# EAGLE design radio (EAGLE 9.6.2)
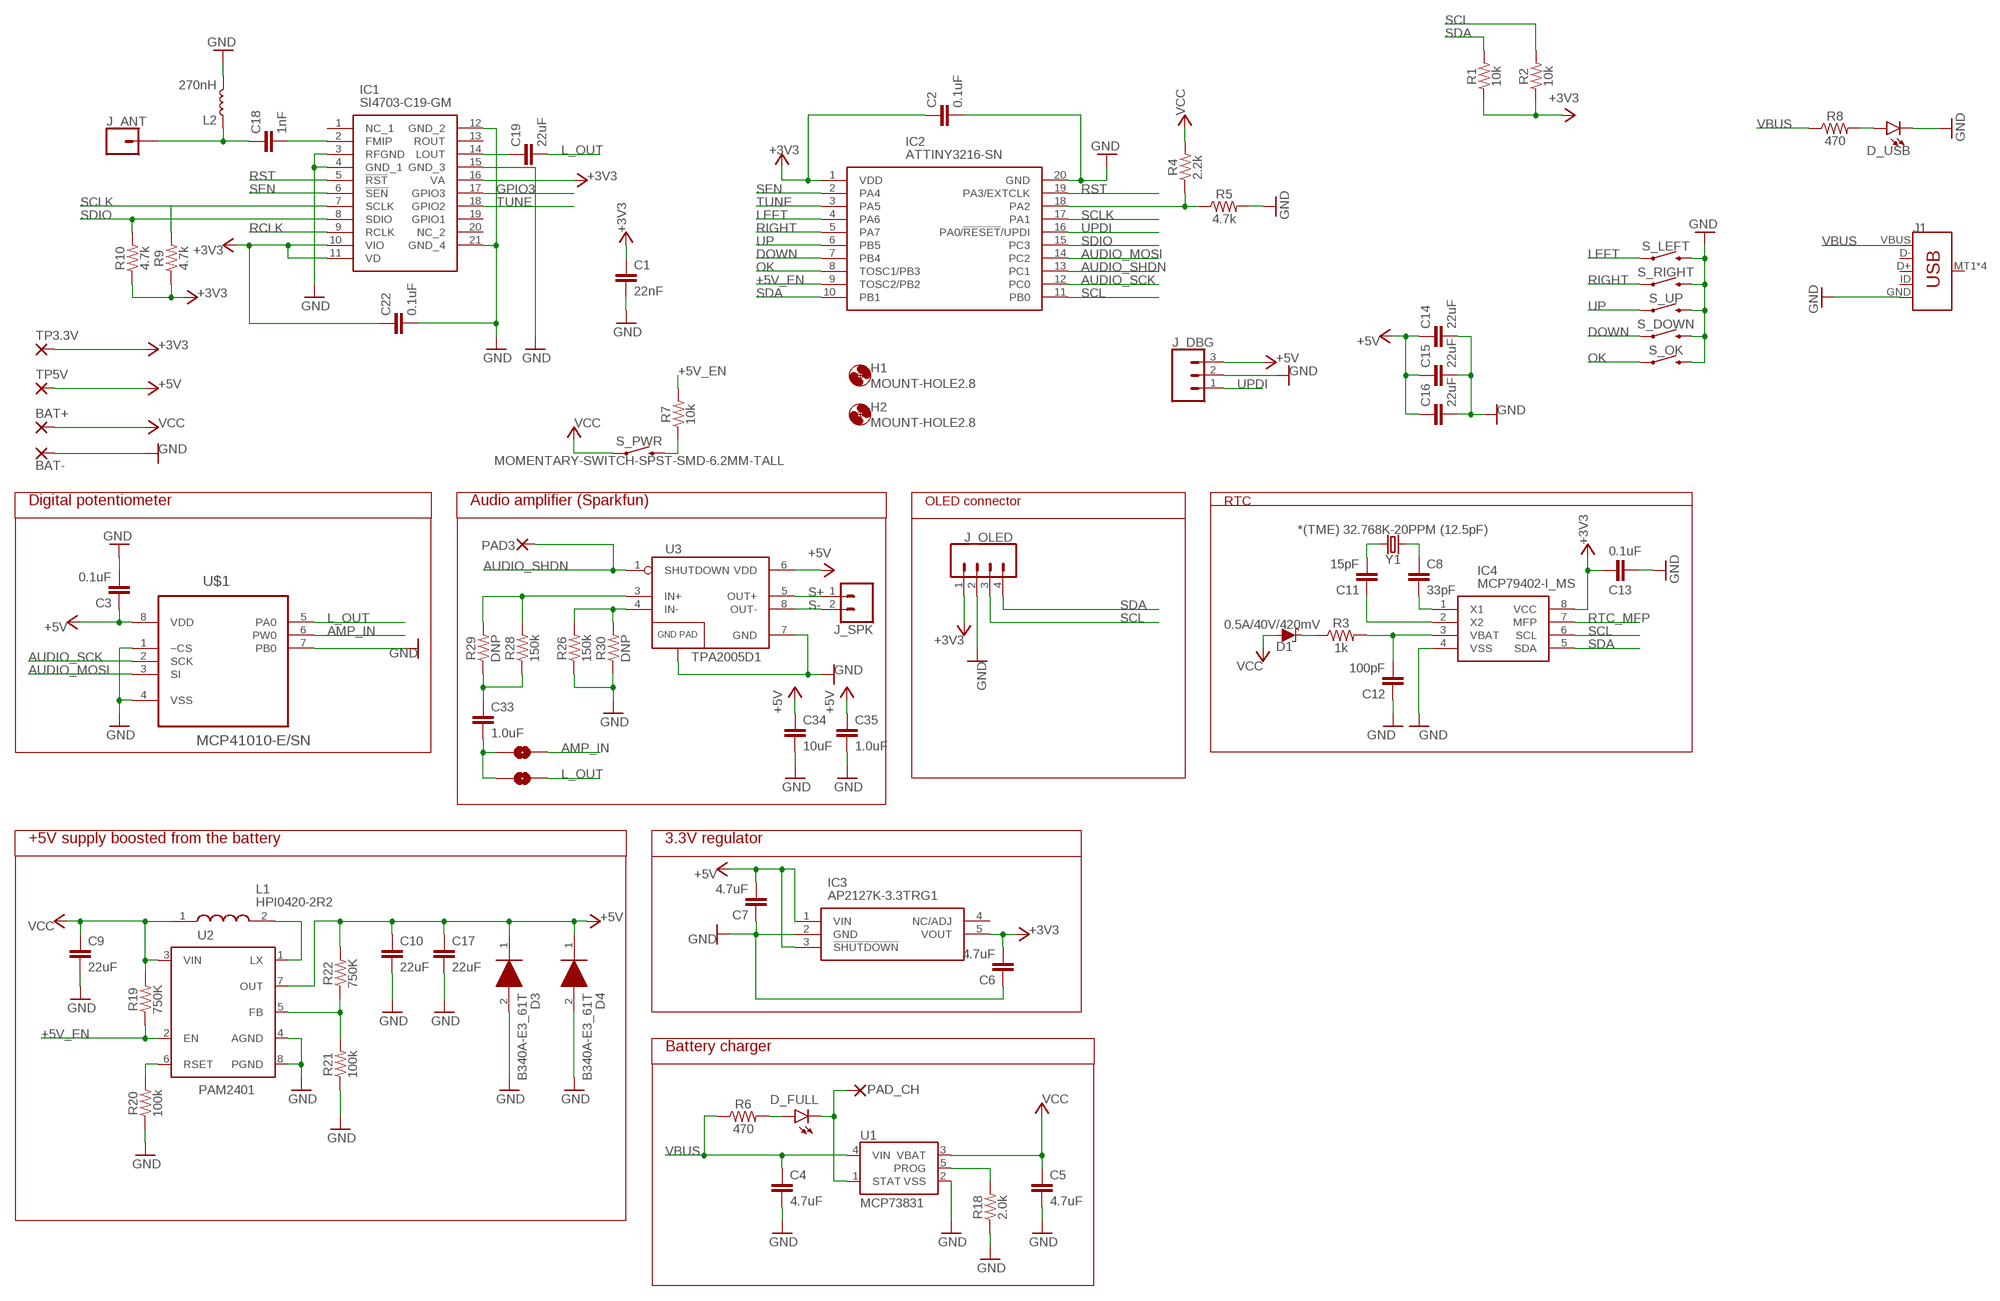
[diagram p0: schematic, sheet 1]

## Parts
BAT+  SMD2  [SMD1,27-2,54]
BAT-  SMD2  [SMD1,27-2,54]
C1  22nF  22NF/22,000PF-0603-50V-10%  [0603]
C2  0.1uF  0.1UF-0603-25V-5%  [0603]
C3  0.1uF  0.1UF-0603-25V-5%  [0603]
C4  4.7uF  4.7UF0603  [0603]
C5  4.7uF  4.7UF0603  [0603]
C6  4.7uF  4.7UF0603  [0603]
C7  4.7uF  4.7UF0603  [0603]
C8  33pF  33PF-0603-50V-5%  [0603]
C9  22uF  22UF-0805-6.3V-20%  [0805]
C10  22uF  22UF-0805-6.3V-20%  [0805]
C11  15pF  15PF-0603-50V-5%  [0603]
C12  100pF  100PF-0603-50V-5%  [0603]
C13  0.1uF  0.1UF-0603-25V-5%  [0603]
C14  22uF  22UF-0805-6.3V-20%  [0805]
C15  22uF  22UF-0805-6.3V-20%  [0805]
C16  22uF  22UF-0805-6.3V-20%  [0805]
C17  22uF  22UF-0805-6.3V-20%  [0805]
C18  1nF  1.0NF/1000PF-0603-50V-10%  [0603]
C19  22uF  22UF-0805-6.3V-20%  [0805]
C22  0.1uF  0.1UF-0603-25V-5%  [0603]
C33  1.0uF  1.0UF-0603-16V-10%  [0603]
C34  10uF  10UF-0805-10V-10%  [0805]
C35  1.0uF  1.0UF-0603-16V-10%  [0603]
D1  0.5A/40V/420mV  DIODE-SCHOTTKY-PMEG4005EJ  [SOD-323]
D3  B340A-E3_61T  [DIOM5127X229N]
D4  B340A-E3_61T  [DIOM5127X229N]
D_FULL  RED  LED5MM  [LED_5MM]
D_USB  LED5MM  [LED_5MM]
H1  MOUNT-HOLE2.8  [2,8]
H2  MOUNT-HOLE2.8  [2,8]
IC1  SI4703-C19-GM  [SI4703C19GM]
IC2  ATTINY3216-SN  [SOIC127P1030X265-20N]
IC3  AP2127K-3.3TRG1  [SOT95P282X145-5N]
IC4  MCP79402-I_MS  [SOP65P490X110-8N]
J1  USB_MICRO-B_SMT  [USB-MICROB]
J_ANT  CONN_01  [1X01]
J_DBG  CONN_03LOCK  [1X03_LOCK]
J_OLED  CONN_04LOCK  [1X04_LOCK]
J_SPK  CONN_02  [1X02]
JP1  JUMPER-SMT_2_NO_NO-SILK  [SMT-JUMPER_2_NO_NO-SILK]
JP2  JUMPER-SMT_2_NO_NO-SILK  [SMT-JUMPER_2_NO_NO-SILK]
L1  HPI0420-2R2  [HPI04202R2]
L2  270nH  INDUCTOR-0805-3.3UH  [0805]
PAD3  SMD2  [SMD1,27-2,54]
PAD_CH  SMD2  [SMD1,27-2,54]
R1  10k  10KOHM-0603-1/10W-1%  [0603]
R2  10k  10KOHM-0603-1/10W-1%  [0603]
R3  1k  1KOHM-0603-1/10W-1%  [0603]
R4  2.2k  2.2KOHM-0603-1/10W-1%  [0603]
R5  4.7k  4.7KOHM-0603-1/10W-1%  [0603]
R6  470  470OHM-0603-1/10W-1%  [0603]
R7  10k  10KOHM-0603-1/10W-1%  [0603]
R8  470  470OHM-0603-1/10W-1%  [0603]
R9  4.7k  4.7KOHM-0603-1/10W-1%  [0603]
R10  4.7k  4.7KOHM-0603-1/10W-1%  [0603]
R18  2.0k  2.0KOHM-0603-1/10W-5%  [0603]
R19  750K  750OHM-0603-1/10W-1%  [0603]
R20  100k  100KOHM-0603-1/10W-1%  [0603]
R21  100k  100KOHM-0603-1/10W-1%  [0603]
R22  750K  750OHM-0603-1/10W-1%  [0603]
R26  150k  150KOHM-0603-1/10W-1%  [0603]
R28  150k  150KOHM-0603-1/10W-1%  [0603]
R29  DNP  150KOHM-0603-1/10W-1%  [0603]
R30  DNP  150KOHM-0603-1/10W-1%  [0603]
S_DOWN  MOMENTARY-SWITCH-SPST-SMD-6.2MM-TALL  [TACTILE_SWITCH_SMD_6.2MM_TALL]
S_LEFT  MOMENTARY-SWITCH-SPST-SMD-6.2MM-TALL  [TACTILE_SWITCH_SMD_6.2MM_TALL]
S_OK  MOMENTARY-SWITCH-SPST-SMD-6.2MM-TALL  [TACTILE_SWITCH_SMD_6.2MM_TALL]
S_PWR  MOMENTARY-SWITCH-SPST-SMD-6.2MM-TALL  [TACTILE_SWITCH_SMD_6.2MM_TALL]
S_RIGHT  MOMENTARY-SWITCH-SPST-SMD-6.2MM-TALL  [TACTILE_SWITCH_SMD_6.2MM_TALL]
S_UP  MOMENTARY-SWITCH-SPST-SMD-6.2MM-TALL  [TACTILE_SWITCH_SMD_6.2MM_TALL]
TP3.3V  SMD2  [SMD1,27-2,54]
TP5V  SMD2  [SMD1,27-2,54]
U1  MCP73831  [SOT23-5]
U2  PAM2401  [MSOP8]
U3  TPA2005D1  TPA2005D1DGN  [POWER-SOP8]
U$1  MCP41010-E/SN  [SOIC127P600X175-8N]
Y1  *(TME) 32.768K-20PPM (12.5pF)  CRYSTAL-32.768KHZPTH-2X6  [CRYSTAL-PTH-2X6-CYL]

## Nets
+3V3 [Power]: C1.1 C2.1 C3.1 C6.2 C13.2 C22.1 IC1.10(VIO) IC1.11(VD) IC1.16(VA) IC2.1(VDD) IC3.5(VOUT) IC4.8(VCC) J_OLED.1 R1.1 R2.1 R9.1 R10.1 TP3.3V.1(P) U$1.8(VDD) ; supply symbol labelled +5V
+5V [Power]: C7.2 C10.1 C14.1 C15.1 C16.1 C17.1 C34.1 C35.1 D3.1(K) D4.1(K) IC3.1(VIN) IC3.3(!SHUTDOWN) J_DBG.3 R22.2 TP5V.1(P) U2.7(OUT) U3.6(VDD)
+5V_EN: IC2.9(TOSC2/PB2) R7.2 R19.1 U2.2(EN)
AMP_IN: JP1.2 U$1.6(PW0)
AUDIO_MOSI: IC2.14(PC2) U$1.3(SI)
AUDIO_SCK: IC2.12(PC0) U$1.2(SCK)
AUDIO_SHDN: IC2.13(PC1) PAD3.1(P) U3.1(SHUTDOWN)
DOWN: IC2.7(PB4) S_DOWN.A2
GND [Power]: BAT-.1(P) C1.2 C2.2 C3.2 C4.2 C5.2 C6.1 C7.1 C9.2 C10.2 C12.1 C13.1 C14.2 C15.2 C16.2 C17.2 C22.2 C34.2 C35.2 D3.2(A) D4.2(A) D_USB.K(C) IC1.3(RFGND) IC1.4(GND_1) IC1.12(GND_2) IC1.15(GND_3) IC1.21(GND_4) IC2.20(GND) IC3.2(GND) IC4.4(VSS) J1.GND J_DBG.2 J_OLED.2 L2.2 R5.2 R18.1 R20.1 R21.1 R26.1 R30.1 S_DOWN.B2 S_LEFT.B2 S_OK.B2 S_RIGHT.B2 S_UP.B2 U1.2(VSS) U2.4(AGND) U2.8(PGND) U3.7(GND) U3.9(GND) U$1.1(~CS) U$1.4(VSS) U$1.7(PB0)
GPIO3: IC1.17(GPIO3)
L_OUT: C19.2 JP2.2 U$1.5(PA0)
LEFT: IC2.4(PA6) S_LEFT.A2
N$1: C18.2 IC1.2(FMIP)
N$2: C8.1 Y1.1
N$3: C8.2 IC4.1(X1)
N$4: D_FULL.K(C) PAD_CH.1(P) U1.1(STAT)
N$5: D_FULL.A R6.2
N$6: C11.2 Y1.2
N$7: C11.1 IC4.2(X2)
N$8: C12.2 IC4.3(VBAT) R3.2
N$9: D1.C R3.1
N$10: R18.2 U1.5(PROG)
N$11: R20.2 U2.6(RSET)
N$12: IC2.18(PA2) R4.1 R5.1
N$13: R7.1 S_PWR.B2
N$14: D_USB.A R8.2
N$15: C18.1 J_ANT.1 L2.1
N$16: C19.1 IC1.14(LOUT)
N$21: L1.2 U2.1(LX)
N$22: R21.2 R22.1 U2.5(FB)
N$25: R28.2 R29.2 U3.3(IN+)
N$27: R26.2 R30.2 U3.4(IN-)
N$29: C33.1 R28.1 R29.1
N$34: C33.2 JP1.1 JP2.1
OK: IC2.8(TOSC1/PB3) S_OK.A2
RCLK: IC1.9(RCLK)
RIGHT: IC2.5(PA7) S_RIGHT.A2
RST: IC1.5(!RST) IC2.19(PA3/EXTCLK)
RTC_MFP: IC4.7(MFP)
S+: J_SPK.1 U3.5(OUT+)
S-: J_SPK.2 U3.8(OUT-)
SCL: IC2.11(PB0) IC4.6(SCL) J_OLED.3 R2.2
SCLK: IC1.7(SCLK) IC2.17(PA1) R9.2
SDA: IC2.10(PB1) IC4.5(SDA) J_OLED.4 R1.2
SDIO: IC1.8(SDIO) IC2.15(PC3) R10.2
SEN: IC1.6(!SEN) IC2.2(PA4)
TUNE: IC1.18(GPIO2) IC2.3(PA5)
UP: IC2.6(PB5) S_UP.A2
UPDI: IC2.16(PA0/!RESET!/UPDI) J_DBG.1
VBUS: C4.1 J1.VBUS R6.1 R8.1 U1.4(VIN)
VCC [Power]: BAT+.1(P) C5.1 C9.1 D1.A L1.1 R4.2 R19.2 S_PWR.A2 U1.3(VBAT) U2.3(VIN)
Unconnected: IC1.1(NC_1) IC1.13(ROUT) IC1.19(GPIO1) IC1.20(NC_2) IC3.4(NC/ADJ) J1.D+ J1.D- J1.ID J1.MT1(SHIELD) J1.MT2(SHIELD) J1.P$1(SHIELD) J1.P$2(SHIELD)

## Notes on the sheet
- Digital potentiometer | Audio amplifier (Sparkfun) | OLED connector | RTC
- +5V supply boosted from the battery | 3.3V regulator
- Battery charger

## Library data of the parts
BAT+ BAT- PAD3 PAD_CH TP3.3V TP5V = wirepad:SMD2: SMD PAD
C1 = SparkFun-Capacitors:22NF/22,000PF: 0.022uF/22nF/22,000pF ceramic capacitors A capacitor is a passive two-terminal electrical component used to store electrical energy temporarily in an electric field.; PROD_ID: CAP-07885
C2 C3 C13 C22 = SparkFun-Capacitors:0.1UF: 0.1µF ceramic capacitors A capacitor is a passive two-terminal electrical component used to store electrical energy temporarily in an electric field.; PROD_ID: CAP-08604
C4-C7 = SparkFun-Capacitors:4.7UF: 4.7µF ceramic capacitors A capacitor is a passive two-terminal electrical component used to store electrical energy temporarily in an electric field.; PROD_ID: CAP-08280
C8 = SparkFun-Capacitors:33PF: 33pF ceramic capacitors A capacitor is a passive two-terminal electrical component used to store electrical energy temporarily in an electric field.; PROD_ID: CAP-10142
C9 C10 C14-C17 C19 = SparkFun-Capacitors:22UF: 22µF ceramic capacitors A capacitor is a passive two-terminal electrical component used to store electrical energy temporarily in an electric field.; PROD_ID: CAP-08402
C11 = SparkFun-Capacitors:15PF: 15pF ceramic capacitors A capacitor is a passive two-terminal electrical component used to store electrical energy temporarily in an electric field.; PROD_ID: CAP-07881
C12 = SparkFun-Capacitors:100PF: 100pF/0.1nF ceramic capacitors A capacitor is a passive two-terminal electrical component used to store electrical energy temporarily in an electric field.; PROD_ID: CAP-07883
C18 = SparkFun-Capacitors:1.0NF/1000PF: 1nF/1,000pF ceramic capacitors A capacitor is a passive two-terminal electrical component used to store electrical energy temporarily in an electric field.; PROD_ID: CAP-07886
C33 C35 = SparkFun-Capacitors:1.0UF: 1µF ceramic capacitors A capacitor is a passive two-terminal electrical component used to store electrical energy temporarily in an electric field.; PROD_ID: CAP-00868
C34 = SparkFun-Capacitors:10UF: 10.0µF ceramic capacitors A capacitor is a passive two-terminal electrical component used to store electrical energy temporarily in an electric field.; PROD_ID: CAP-11330
D1 = SparkFun-DiscreteSemi:DIODE-SCHOTTKY: Schottky diode A Schottky diode is a semiconductor diode which has a low forward voltage drop and a very fast switching action.; PROD_ID: DIO-10955
D3 D4 = SamacSys_Parts:B340A-E3_61T: VISHAY - B340A-E3/61T - Schottky Rectifier, 40 V, 3 A, Single, DO-214AC (SMA), 2 Pins, 550 mV Source: Datasheet <https://ms.componentsearchengine.com/Datasheets/2/B340A-E3_61T.pdf>; ARROW_PART_NUMBER: B340A-E3/61T; ARROW_PRICE-STOCK: https://www.arrow.com/en/products/b340a-e361t/vishay; DESCRIPTION: VISHAY - B340A-E3/61T - Schottky Rectifier, 40 V, 3 A, Single, DO-214AC (SMA), 2 Pins, 550 mV; HEIGHT: 2.29mm; MANUFACTURER_NAME: Vishay; MANUFACTURER_PART_NUMBER: B340A-E3/61T; MOUSER_PART_NUMBER: 625-BD340A-E3/61T; MOUSER_PRICE-STOCK: https://www.mouser.co.uk/ProductDetail/Vishay-General-Semiconductor/B340A-E3-61T/?qs=tdXsjSi%2FIMY4I2dGLbnpzg%3D%3D
D_FULL D_USB = SparkFun-LED:LED: LED (Generic) Standard schematic elements and footprints for 5mm, 3mm, 1206, and 0603 sized LEDs. Generic LEDs with no color specified.
H1 H2 = holes:MOUNT-HOLE: MOUNTING HOLE with drill center marker
IC1 = SamacSys_Parts:SI4703-C19-GM: SILICON LABS - SI4703-C19-GM - RF RECEIVER, 108MHZ, -20 TO 85DEG C Source: Datasheet <https://www.mouser.com/datasheet/2/368/Si4702-03-C19-1397768.pdf>; ARROW_PART_NUMBER: SI4703-C19-GM; ARROW_PRICE-STOCK: https://www.arrow.com/en/products/si4703-c19-gm/silicon-labs; DESCRIPTION: SILICON LABS - SI4703-C19-GM - RF RECEIVER, 108MHZ, -20 TO 85DEG C; HEIGHT: 0.55mm; MANUFACTURER_NAME: Silicon Labs; MANUFACTURER_PART_NUMBER: Si4703-C19-GM; MOUSER_PART_NUMBER: 634-SI4703-C19-GM; MOUSER_PRICE-STOCK: https://www.mouser.co.uk/ProductDetail/Silicon-Labs/SI4703-C19-GM?qs=JiL6vA75y8O1ZAxL45qs%252BQ%3D%3D
IC2 = SamacSys_Parts:ATTINY3216-SN: MICROCHIP - ATTINY3216-SN - 8 Bit MCU, AVR Family ATtiny3216 Series Microcontrollers, 20 MHz, 32 KB, 2 KB, 20 Pins, SOIC Source: Datasheet <http://www.microchip.com/mymicrochip/filehandler.aspx?ddocname=en606269>; ARROW_PART_NUMBER: ATTINY3216-SN; ARROW_PRICE-STOCK: https://www.arrow.com/en/products/attiny3216-sn/microchip-technology; DESCRIPTION: MICROCHIP - ATTINY3216-SN - 8 Bit MCU, AVR Family ATtiny3216 Series Microcontrollers, 20 MHz, 32 KB, 2 KB, 20 Pins, SOIC; HEIGHT: 2.65mm; MANUFACTURER_NAME: Microchip; MANUFACTURER_PART_NUMBER: ATTINY3216-SN; MOUSER_PART_NUMBER: 579-ATTINY3216-SN; MOUSER_PRICE-STOCK: https://www.mouser.co.uk/ProductDetail/Microchip-Technology-Atmel/ATTINY3216-SN?qs=3HJ2avRr9PLFi4K6RTZWjQ%3D%3D
IC3 = SamacSys_Parts:AP2127K-3.3TRG1: DiodesZetex AP2127K-3.3TRG1, LDO Regulator, 3.3 V, +/-2% 5-Pin, SOT-23 Source: Datasheet <https://www.diodes.com/assets/Datasheets/AP2127.pdf>; ARROW_PART_NUMBER: AP2127K-3.3TRG1; ARROW_PRICE-STOCK: https://www.arrow.com/en/products/ap2127k-3.3trg1/diodes-incorporated; DESCRIPTION: DiodesZetex AP2127K-3.3TRG1, LDO Regulator, 3.3 V, +/-2% 5-Pin, SOT-23; HEIGHT: 1.45mm; MANUFACTURER_NAME: Diodes Inc.; MANUFACTURER_PART_NUMBER: AP2127K-3.3TRG1; MOUSER_PART_NUMBER: 621-AP2127K-3.3TRG1; MOUSER_PRICE-STOCK: https://www.mouser.co.uk/ProductDetail/Diodes-Incorporated/AP2127K-33TRG1?qs=x6A8l6qLYDCeAxisWuFs5g%3D%3D
IC4 = SamacSys_Parts:MCP79402-I_MS: Real Time Clock I2C GP RTCC 64B SRAM EUI-64 Source: Datasheet <https://ww1.microchip.com/downloads/en/DeviceDoc/MCP79400-MCP79401-MCP79402-Data-Sheet-20005009G.pdf>; ARROW_PART_NUMBER: MCP79402-I/MS; ARROW_PRICE-STOCK: https://www.arrow.com/en/products/mcp79402-ims/microchip-technology; DESCRIPTION: Real Time Clock I2C GP RTCC 64B SRAM EUI-64; HEIGHT: 1.1mm; MANUFACTURER_NAME: Microchip; MANUFACTURER_PART_NUMBER: MCP79402-I/MS; MOUSER_PART_NUMBER: 579-MCP79402IMS; MOUSER_PRICE-STOCK: https://www.mouser.co.uk/ProductDetail/Microchip-Technology/MCP79402-I-MS/?qs=ggQiQSXuoRUEDQIZeudJWQ%3D%3D
J1 = SparkFun-Connectors:USB_MICRO-B: USB Type Micro-B Connector Male/female and PTH/SMT variants SparkFun Products: SparkFun microB USB Breakout <https://www.sparkfun.com/products/12035> SparkFun USB microB Plug Breakout <https://www.sparkfun.com/products/10031> SparkFun ESP8266 Thing <https://www.sparkfun.com/products/13231>; PROD_ID: CONN-09505; SF_ID: PRT-08533
J_ANT = SparkFun-Connectors:CONN_01: Single connection point. Often used as Generic Header-pin footprint for 0.1 inch spaced/style header connections On any of the 0.1 inch spaced packages, you can populate with these: Break Away Headers - Straight <https://www.sparkfun.com/products/116> (PRT-00116) Break Away Male Headers - Right Angle <https://www.sparkfun.com/products/553> (PRT-00553) Female Headers <https://www.sparkfun.com/products/115> (PRT-00115) Break Away Headers - Machine Pin <https://www.sparkfun.com/products/117> (PRT-00117) Break Away Female Headers - Swiss Machine Pin <https://www.sparkfun.com/products/743> (PRT-00743) This device is also useful as a general connection point to wire up your design to another part of your project. Our various solder wires solder well into these plated through hole pads. Hook-Up Wire - Assortment (Stranded, 22 AWG) <https://www.sparkfun.com/products/11375> (PRT-11375) Hook-Up Wire - Assortment (Solid Core, 22 AWG) <https://www.sparkfun.com/products/11367> (PRT-11367) View the entire wire category on our website here <https://www.sparkfun.com/categories/141> Special notes: SMTSO-256-ET is a "flush mount" nut for a 4-40 screw. We mostly use this on specialty testbeds; it is a nice way to connect hardware to your PCB at an adjustable hieght. Also note, the SNAP packages are for using a snappable style connector. We sell a baggie of snaps and they are also used on two LilyPad designs: Snap Assortment - 30 pack (male and female) <https://www.sparkfun.com/products/11347> (DEV-11347) LilyPad Arduino SimpleSnap <https://www.sparkfun.com/products/10941> (DEV-10941) LilyPad SimpleSnap Protoboard <https://www.sparkfun.com/products/10940> (DEV-10940)
J_DBG = SparkFun-Connectors:CONN_03: Multi connection point. Often used as Generic Header-pin footprint for 0.1 inch spaced/style header connections On any of the 0.1 inch spaced packages, you can populate with these: Break Away Headers - Straight <https://www.sparkfun.com/products/116> (PRT-00116) Break Away Male Headers - Right Angle <https://www.sparkfun.com/products/553> (PRT-00553) Female Headers <https://www.sparkfun.com/products/115> (PRT-00115) Break Away Headers - Machine Pin <https://www.sparkfun.com/products/117> (PRT-00117) Break Away Female Headers - Swiss Machine Pin <https://www.sparkfun.com/products/743> (PRT-00743) Stackable Header - 3 Pin (Female, 0.1") <https://www.sparkfun.com/products/13875> (PRT-13875) For SCREWTERMINALS and SPRING TERMINALS visit here: Screw Terimnals on SparkFun.com <https://www.sparkfun.com/search/results?term=Screw+Terminals> (5mm/3.5mm/2.54mm spacing) This device is also useful as a general connection point to wire up your design to another part of your project. Our various solder wires solder well into these plated through hole pads. Hook-Up Wire - Assortment (Stranded, 22 AWG) <https://www.sparkfun.com/products/11375> (PRT-11375) Hook-Up Wire - Assortment (Solid Core, 22 AWG) <https://www.sparkfun.com/products/11367> (PRT-11367) View the entire wire category on our website here <https://www.sparkfun.com/categories/141> Special notes: Molex polarized connector foot print use with SKU : PRT-08232 with associated crimp pins and housings.
J_OLED = SparkFun-Connectors:CONN_04: Multi connection point. Often used as Generic Header-pin footprint for 0.1 inch spaced/style header connections On any of the 0.1 inch spaced packages, you can populate with these: Break Away Headers - Straight <https://www.sparkfun.com/products/116> (PRT-00116) Break Away Male Headers - Right Angle <https://www.sparkfun.com/products/553> (PRT-00553) Female Headers <https://www.sparkfun.com/products/115> (PRT-00115) Break Away Headers - Machine Pin <https://www.sparkfun.com/products/117> (PRT-00117) Break Away Female Headers - Swiss Machine Pin <https://www.sparkfun.com/products/743> (PRT-00743) For SCREWTERMINALS and SPRING TERMINALS visit here: Screw Terimnals on SparkFun.com <https://www.sparkfun.com/search/results?term=Screw+Terminals> (5mm/3.5mm/2.54mm spacing) This device is also useful as a general connection point to wire up your design to another part of your project. Our various solder wires solder well into these plated through hole pads. Hook-Up Wire - Assortment (Stranded, 22 AWG) <https://www.sparkfun.com/products/11375> (PRT-11375) Hook-Up Wire - Assortment (Solid Core, 22 AWG) <https://www.sparkfun.com/products/11367> (PRT-11367) View the entire wire category on our website here <https://www.sparkfun.com/categories/141> Special notes: Molex polarized connector foot print use with SKU : PRT-08231 with associated crimp pins and housings. 1MM SMD Version SKU: PRT-10208; PROD_ID: CONN-09696
J_SPK = SparkFun-Connectors:CONN_02: Multi connection point. Often used as Generic Header-pin footprint for 0.1 inch spaced/style header connections On any of the 0.1 inch spaced packages, you can populate with these: Break Away Headers - Straight <https://www.sparkfun.com/products/116> (PRT-00116) Break Away Male Headers - Right Angle <https://www.sparkfun.com/products/553> (PRT-00553) Female Headers <https://www.sparkfun.com/products/115> (PRT-00115) Break Away Headers - Machine Pin <https://www.sparkfun.com/products/117> (PRT-00117) Break Away Female Headers - Swiss Machine Pin <https://www.sparkfun.com/products/743> (PRT-00743) For SCREWTERMINALS and SPRING TERMINALS visit here: Screw Terimnals on SparkFun.com <https://www.sparkfun.com/search/results?term=Screw+Terminals> (5mm/3.5mm/2.54mm spacing) This device is also useful as a general connection point to wire up your design to another part of your project. Our various solder wires solder well into these plated through hole pads. Hook-Up Wire - Assortment (Stranded, 22 AWG) <https://www.sparkfun.com/products/11375> (PRT-11375) Hook-Up Wire - Assortment (Solid Core, 22 AWG) <https://www.sparkfun.com/products/11367> (PRT-11367) View the entire wire category on our website here <https://www.sparkfun.com/categories/141> Special notes: Molex polarized connector foot print use with: PRT-08233 with associated crimp pins and housings. 2.54_SCREWTERM for use with PRT-10571. 3.5mm Screw Terminal footprints for PRT-08084 5mm Screw Terminal footprints for use with PRT-08432
JP1 JP2 = SparkFun-Jumpers:JUMPER-SMT_2_NO: Normally open jumper This jumper has two pads in close proximity to each other. Apply solder to close the connection. Round pads are easier to solder for beginners, but are a lot larger. SparkFun Product that uses the round pads: SparkFun EL Sequencer <https://www.sparkfun.com/products/12781>
L1 = SamacSys_Parts:HPI0420-2R2: Inductor: wire; SMD; 2.2uH; Ioper: 3A; 60m; +/-20%; Isat: 3.5A Source: Datasheet <https://www.tme.eu/Document/b467ae6daee59df5e2ed68809c99b965/HPI0420.pdf>; DESCRIPTION: Inductor: wire; SMD; 2.2uH; Ioper: 3A; 60m; +/-20%; Isat: 3.5A; HEIGHT: 2mm; MANUFACTURER_NAME: FERROCORE; MANUFACTURER_PART_NUMBER: HPI0420-2R2
L2 = SparkFun-Coils:INDUCTOR: Inductors Resist changes in electrical current. Basically a coil of wire. SparkFun Products: SparkFun Load Cell Amplifier - HX711 <https://www.sparkfun.com/products/13879> IOIO-OTG - V2.2 <https://www.sparkfun.com/products/13613>; PROD_ID: NDUC-13076; VALUE: 3.3µH/±20%/450mA
R1 R2 R7 = SparkFun-Resistors:10KOHM: 10kΩ resistor A resistor is a passive two-terminal electrical component that implements electrical resistance as a circuit element. Resistors act to reduce current flow, and, at the same time, act to lower voltage levels within circuits. - Wikipedia; PROD_ID: RES-00824
R3 = SparkFun-Resistors:1KOHM: 1kΩ resistor A resistor is a passive two-terminal electrical component that implements electrical resistance as a circuit element. Resistors act to reduce current flow, and, at the same time, act to lower voltage levels within circuits. - Wikipedia; PROD_ID: RES-07856
R4 = SparkFun-Resistors:2.2KOHM: 2.2kΩ resistor A resistor is a passive two-terminal electrical component that implements electrical resistance as a circuit element. Resistors act to reduce current flow, and, at the same time, act to lower voltage levels within circuits. - Wikipedia; PROD_ID: RES-08272
R5 R9 R10 = SparkFun-Resistors:4.7KOHM: 4.7kΩ resistor A resistor is a passive two-terminal electrical component that implements electrical resistance as a circuit element. Resistors act to reduce current flow, and, at the same time, act to lower voltage levels within circuits. - Wikipedia; PROD_ID: RES-07857
R6 R8 = SparkFun-Resistors:470OHM: 470Ω resistor A resistor is a passive two-terminal electrical component that implements electrical resistance as a circuit element. Resistors act to reduce current flow, and, at the same time, act to lower voltage levels within circuits. - Wikipedia; PROD_ID: RES-07869
R18 = SparkFun-Resistors:2.0KOHM: 2kΩ resistor A resistor is a passive two-terminal electrical component that implements electrical resistance as a circuit element. Resistors act to reduce current flow, and, at the same time, act to lower voltage levels within circuits. - Wikipedia; PROD_ID: RES-08296
R19 R22 = SparkFun-Resistors:750OHM: 750Ω resistor A resistor is a passive two-terminal electrical component that implements electrical resistance as a circuit element. Resistors act to reduce current flow, and, at the same time, act to lower voltage levels within circuits. - Wikipedia; PROD_ID: RES-07824; VALUE: 750
R20 R21 = SparkFun-Resistors:100KOHM: 100kΩ resistor A resistor is a passive two-terminal electrical component that implements electrical resistance as a circuit element. Resistors act to reduce current flow, and, at the same time, act to lower voltage levels within circuits. - Wikipedia; PROD_ID: RES-07828
R26 R28 = SparkFun-Resistors:150KOHM: 150kΩ resistor A resistor is a passive two-terminal electrical component that implements electrical resistance as a circuit element. Resistors act to reduce current flow, and, at the same time, act to lower voltage levels within circuits. - Wikipedia; PROD_ID: RES-09117
R29 R30 = SparkFun-Resistors:150KOHM: 150kΩ resistor A resistor is a passive two-terminal electrical component that implements electrical resistance as a circuit element. Resistors act to reduce current flow, and, at the same time, act to lower voltage levels within circuits. - Wikipedia; PROD_ID: RES-09117; VALUE: 150k
S_DOWN S_LEFT S_OK S_PWR S_RIGHT S_UP = SparkFun-Switches:MOMENTARY-SWITCH-SPST: Momentary Switch (Pushbutton) - SPST Normally-open (NO) SPST momentary switches (buttons, pushbuttons). Variants PTH-12MM - 12mm square, through-hole Momentary Pushbutton Switch - 12mm Square <https://www.sparkfun.com/products/9190> (COM-09190) PTH-6.0MM, PTH-6.0MM-KIT - 6.0mm square, through-hole Mini Pushbutton Switch <https://www.sparkfun.com/products/97> (COM-00097) KIT package intended for soldering kit's - only one side of pads' copper is exposed. PTH-RIGHT-ANGLE-KIT - Right-angle, through-hole Right Angle Tactile Button <https://www.sparkfun.com/products/10791> - Used on SparkFun BigTime Watch Kit <https://www.sparkfun.com/products/11734> SMD-12MM - 12mm square, surface-mount Tactile Button - SMD (12mm) <https://www.sparkfun.com/products/12993> (COM-12993) Used on SparkFun PicoBoard <https://www.sparkfun.com/products/11888> SMD-4.5MM - 4.5mm Square Trackball Switch Used on SparkFun Blackberry Trackballer Breakout <https://www.sparkfun.com/products/13169> SMD-4.6MMX2.8MM - 4.60mm x 2.80mm, surface mount Used on SparkFun SAMD21 Mini Breakout <https://www.sparkfun.com/products/13664> SMD-5.2MM, SMD-5.2-REDUNDANT - 5.2mm square, surface-mount Mini Pushbutton Switch - SMD <https://www.sparkfun.com/products/8720> (COM-08720) Used on Arduino Pro Mini <https://www.sparkfun.com/products/11114> REDUNDANT package connects both switch circuits together SMD-6.0X3.5MM - 6.0 x 3.5mm, surface mount Momentary Reset Switch SMD <https://www.sparkfun.com/products/8229> (COM-08229) SMD-6.2MM-TALL - 6.2mm square, surface mount Tactile Button - SMD (6mm) <https://www.sparkfun.com/products/12992> Used on SparkFun Digital Sandbox <https://www.sparkfun.com/products/12651> SMD-RIGHT-ANGLE - Right-angle, surface mount Used on SparkFun Block for Intel® Edison - Arduino <https://www.sparkfun.com/products/13036>; PROD_ID: SWCH-11966; SF_SKU: COM-12992
U1 = SparkFun-IC-Power:MCP73831: MCP73831T Li-Ion, Li-Pol Controller Miniature single cell, fully integrated Li-Ion, Li-polymer charge management controller Datasheet <http://ww1.microchip.com/downloads/en/DeviceDoc/20001984g.pdf> SparkFun Products: SparkFun ESP32 Thing <https://www.sparkfun.com/products/13907> SparkFun 9DoF Razor IMU M0 <https://www.sparkfun.com/products/14001>; PROD_ID: IC-09995
U2 = SparkFun-IC-Power:PAM2401: PAM2401 - Boost PMIC Specifications: Up to 1A output current 0.9V to 4.75V Input Range 2.5V to 5.0V Adjustable Output Voltage Datasheet <https://www.diodes.com/assets/Datasheets/PAM2401.pdf> (Diodes inc.); PROD_ID: IC-XXXXX
U3 = SparkFun-IC-Amplifiers:TPA2005D1: 1.4W MONO CLASS-D AUDIO POWER AMPLIFIER The TPA2005D1 is a 1.4-W high efficiency filter-free class-D audio power amplifier in a BGA, QFN, or MSOP package that requires only three external components. Datasheet: http://focus.ti.com/lit/ds/symlink/tpa2005d1.pdf 1.4 W Into 8 ? From a 5V Supply at THD = 10% (Typ) Maximum Battery Life and Minimum Heat Efficiency With an 8-? Speaker: 84% at 400 mW, 79% at 100 mW 2.8-mA Quiescent Current 0.5-mA Shutdown Current Ideal for Wireless or Cellular Handsets and PDAs Capable of Driving an 8-? Speaker (2.5 V ? VDD ? 5.5 V) and a 4-? Speaker (2.5 V ? VDD ? 4.2 V) Only Three External Components Optimized PWM Output Stage Eliminates LC Output Filter Internally Generated 250-kHz Switching Frequency Eliminates Capacitor and Resistor Improved PSRR (-71 dB at 217 Hz) and Wide Supply Voltage (2.5 V to 5.5 V) Eliminates Need for a Voltage Regulator Fully Differential Design Reduces RF Rectification and Eliminates Bypass Capacitor Improved CMRR Eliminates Two Input Coupling Capacitors SparkFun Products SparkFun Mono Audio Amp Breakout - TPA2005D1 <https://www.sparkfun.com/products/11044> (BOB-11044) Note: SparkFun currenly only uses the QFN style part; PROD_ID: NA-XXXXX
U$1 = Microchip_By_element14_Batch_1:MCP41010-E/SN: Digital Potentiometer; MPN: MCP41010-E/SN; OC_FARNELL: 1332109; OC_NEWARK: 34M7457; PACKAGE: SOIC-8; SUPPLIER: Microchip
Y1 = SparkFun-Clocks:CRYSTAL-32.768KHZ: 32.768kHz Crystal Frequency: 32.768kHz Frequency Stability: ±20ppm Load Capacitance: 12.5pF (PTH-2X6 & SMD-3.2X1.5), 6pF (SMD-2X6) SparkFun Products: SparkFun BigTime Watch Kit <https://www.sparkfun.com/products/11734> SparkFun nRF52832 Breakout <https://www.sparkfun.com/products/13990> SparkFun Real Time Clock Module <https://www.sparkfun.com/products/12708>; PROD_ID: XTAL-10112; VALUE: 32.768kHz

## Board
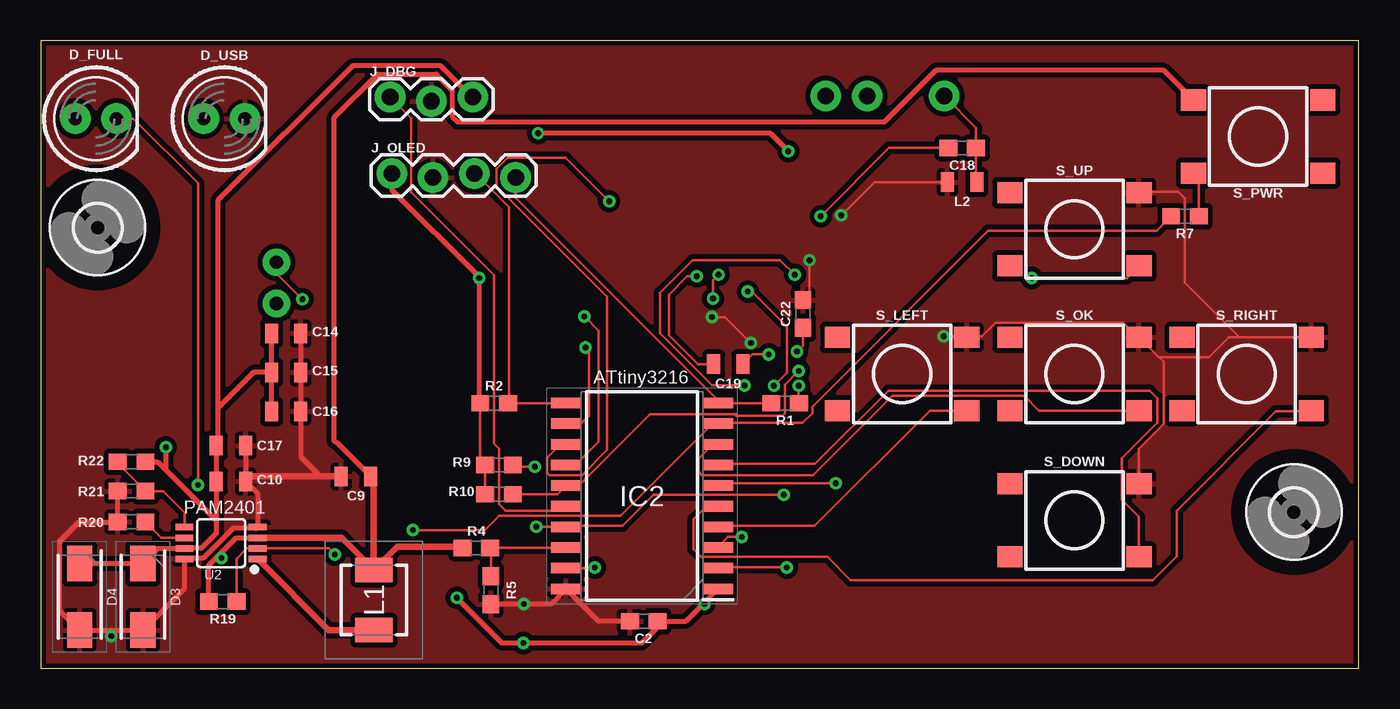
[diagram p1: board, top side]
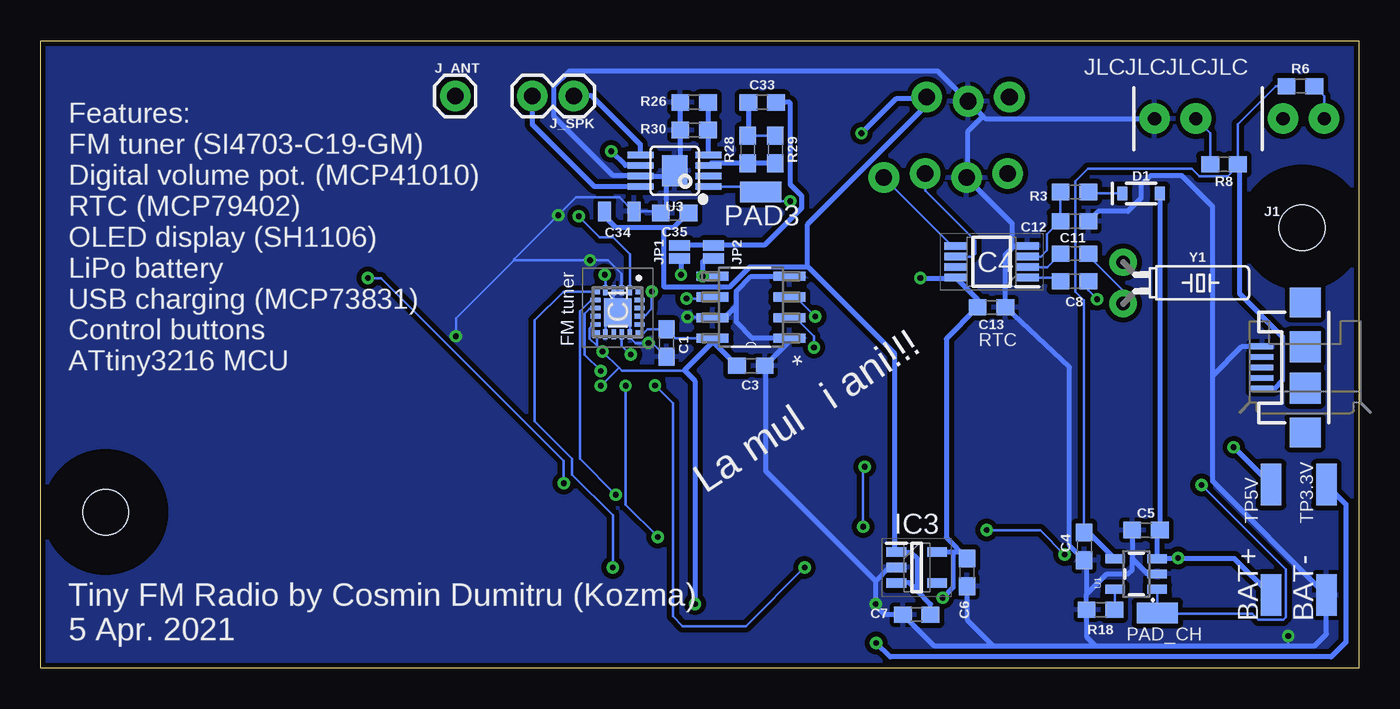
[diagram p2: board, bottom side, seen from below]

Size 81.1 x 38.6 mm. Coordinates in mm from the lower left corner, seen from the top.
Outline: 0,0 81.1,0 81.1,38.6 0,38.6 0,0
Copper layers (1*16): Top 0.035mm / dielectric 1.5mm / Bottom 0.035mm
Design rules "default *": minimum track width 6mil, minimum drill 0.35mm, track to track 3mil, track to pad 3mil, pad to pad 3mil, via to via 3mil, smd to smd 3mil, copper to edge 10mil, drill to drill 6mil, minimum pad ring 10mil, minimum via ring 8mil, stop-mask expansion 0mil, vias tented up to drill 40mil, thermal gap 10mil

### Footprints (pad centres in the part's own frame; a part is rotated, then mirrored left to right if it is on the bottom)
SMD1,27-2,54 = smd 1.27 x 2.54: 1 0,0
0603 = smd 1.1 x 1: 1 -0.85,0; 2 0.85,0
0805 = smd 0.8 x 1.2: 1 -0.9,0; 2 0.9,0
SOD-323 = smd 0.63 x 0.83: A 1.15,0; C -1.15,0
DIOM5127X229N = smd 2.2 x 1.55: 1 -2.05,0; 2 2.05,0
LED_5MM = drill 0.813 pad 1.88: A -1.27,0; K 1.27,0
2,8 = hole 2.8: 0,0
SI4703C19GM = smd 0.34 x 0.34: 1 -1.265,1.265; 6 -1.265,-1.265; 11 1.265,-1.265; 16 1.265,1.265 | smd 0.61 x 0.28: 2 -1.355,0.75; 3 -1.355,0.25; 4 -1.355,-0.25; 5 -1.355,-0.75; 12 1.355,-0.75; 13 1.355,-0.25; 14 1.355,0.25; 15 1.355,0.75 | smd 0.28 x 0.61: 7 -0.75,-1.355; 8 -0.25,-1.355; 9 0.25,-1.355; 10 0.75,-1.355; 17 0.75,1.355; 18 0.25,1.355; 19 -0.25,1.355; 20 -0.75,1.355 | smd 1.7 x 1.7: 21 0,0
SOIC127P1030X265-20N = smd 1.85 x 0.65: 1 -4.675,5.715; 2 -4.675,4.445; 3 -4.675,3.175; 4 -4.675,1.905; 5 -4.675,0.635; 6 -4.675,-0.635; 7 -4.675,-1.905; 8 -4.675,-3.175; 9 -4.675,-4.445; 10 -4.675,-5.715; 11 4.675,-5.715; 12 4.675,-4.445; 13 4.675,-3.175; 14 4.675,-1.905; 15 4.675,-0.635; 16 4.675,0.635; 17 4.675,1.905; 18 4.675,3.175; 19 4.675,4.445; 20 4.675,5.715
SOT95P282X145-5N = smd 1.2 x 0.6: 1 -1.25,0.95; 2 -1.25,0; 3 -1.25,-0.95; 4 1.25,-0.95; 5 1.25,0.95
SOP65P490X110-8N = smd 1.4 x 0.45: 1 -2.2,0.975; 2 -2.2,0.325; 3 -2.2,-0.325; 4 -2.2,-0.975; 5 2.2,-0.975; 6 2.2,-0.325; 7 2.2,0.325; 8 2.2,0.975
USB-MICROB = smd 1.4 x 0.35: D+ -2.65,0; D- -2.65,-0.65; GND -2.65,1.3; ID -2.65,0.65; VBUS -2.65,-1.3 | smd 1.9 x 1.8: MT1 0,-4; MT2 0,4 | smd 1.9 x 1.9: P$1 0,-1.27; P$2 0,1.27
1X01 = drill 1.016 pad 1.88: 1 0,0
1X03_LOCK = drill 1.016 pad 1.88: 1 0,0.127; 2 2.54,-0.127; 3 5.08,0.127
1X04_LOCK = drill 1.016 pad 1.88: 1 0,0.127; 2 2.54,-0.127; 3 5.08,0.127; 4 7.62,-0.127
1X02 = drill 1.016 pad 1.88: 1 0,0; 2 2.54,0
SMT-JUMPER_2_NO_NO-SILK = smd 0.635 x 1.27: 1 -0.406,0; 2 0.406,0
HPI04202R2 = smd 1.5 x 2.3: 1 -1.85,0; 2 1.85,0
TACTILE_SWITCH_SMD_6.2MM_TALL = smd 1.55 x 1.3: A1 -3.975,-2.25; A2 3.975,-2.25; B1 -3.975,2.25; B2 3.975,2.25
SOT23-5 = smd 0.55 x 1.2: 1 -0.95,-1.3; 2 0,-1.3; 3 0.95,-1.3; 4 0.95,1.3; 5 -0.95,1.3
MSOP8 = smd 0.4 x 1.1: 1 -0.975,-2.25; 2 -0.325,-2.25; 3 0.325,-2.25; 4 0.975,-2.25; 5 0.975,2.25; 6 0.325,2.25; 7 -0.325,2.25; 8 -0.975,2.25
POWER-SOP8 = smd 0.4 x 1.6: 1 -0.975,-2.1; 2 -0.325,-2.1; 3 0.325,-2.1; 4 0.975,-2.1; 5 0.975,2.1; 6 0.325,2.1; 7 -0.325,2.1; 8 -0.975,2.1 | smd 1.89 x 1.57: 9 0,0
SOIC127P600X175-8N = smd 1.981 x 0.559: 1 -2.362,1.905; 2 -2.362,0.635; 3 -2.362,-0.635; 4 -2.362,-1.905; 5 2.362,-1.905; 6 2.362,-0.635; 7 2.362,0.635; 8 2.362,1.905
CRYSTAL-PTH-2X6-CYL = drill 0.813 pad 1.676: 1 -1.27,0; 2 1.27,0

### Placement (x,y rotation side)
BAT+  5.4,4.5 0 bottom
BAT-  2,4.5 0 bottom
C1  42.6,20 270 bottom
C2  37.1,2.9 180 top
C3  37.4,18.6 0 bottom
C4  16.9,7.5 270 bottom
C5  13.1,8.5 180 bottom
C6  24.1,5.9 90 bottom
C7  27.2,3.3 0 bottom
C8  17.5,23.8 180 bottom
C9  19.4,11.8 180 top
C10  11.7,11.5 0 top
C11  17.5,25.5 0 bottom
C12  17.5,27.5 180 bottom
C13  22.6,22.2 180 bottom
C14  15.1,20.6 0 top
C15  15.1,18.2 0 top
C16  15.1,15.8 0 top
C17  11.7,13.7 0 top
C18  56.7,32 180 top
C19  42.3,18.7 180 top
C22  46.9,21.8 90 top
C33  36.7,34.8 0 bottom
C34  45.5,28.1 0 bottom
C35  42.1,28 180 bottom
D1  13.4,29.2 0 bottom
D3  6.3,4.4 270 top
D4  2.4,4.4 270 top
D_FULL  3.4,33.8 0 top
D_USB  11.3,33.8 0 top
H1  77.1,9.6 0 top
H2  3.5,27.1 0 top
IC1  45.6,21.9 270 bottom
IC2  37,10.6 180 top
IC3  27.2,6.2 0 bottom
IC4  22.6,25 180 bottom
J1  3.3,18.5 0 bottom
J_ANT  55.6,35.2 0 bottom
J_DBG  21.5,35 0 top
J_OLED  21.6,30.3 0 top
J_SPK  48.3,35.2 180 bottom
JP1  41.8,25.6 270 bottom
JP2  39.7,25.6 270 bottom
L1  20.5,4.2 270 top
L2  56.7,29.9 180 top
PAD3  36.8,29.3 90 bottom
PAD_CH  12.4,3.4 270 bottom
R1  45.8,16.3 180 top
R2  27.9,16.3 0 top
R3  17.5,29.3 180 bottom
R4  26.8,7.4 180 top
R5  27.7,4.8 270 top
R6  3.6,35.8 0 bottom
R7  70.4,27.8 180 top
R8  8.3,31 180 bottom
R9  28.2,12.5 0 top
R10  28.2,10.7 0 top
R18  15.9,3.6 0 bottom
R19  11.2,4.1 180 top
R20  5.6,9 0 top
R21  5.6,10.9 0 top
R22  5.6,12.7 0 top
R26  40.9,34.8 0 bottom
R28  37.6,31.9 270 bottom
R29  35.9,31.9 270 bottom
R30  40.9,33.1 0 bottom
S_DOWN  63.6,9.1 0 top
S_LEFT  53,18.1 0 top
S_OK  63.6,18.1 0 top
S_PWR  74.9,32.7 180 top
S_RIGHT  74.2,18.1 0 top
S_UP  63.6,27 0 top
TP3.3V  2,11.3 0 bottom
TP5V  5.4,11.3 0 bottom
U1  13.7,5.8 90 bottom
U2  11.1,7.7 90 top
U3  42.1,30.6 90 bottom
U$1  37.4,22.2 180 bottom
Y1  14.5,23.7 270 bottom

### Tracks (layer width: path | path; a pad name or v marks a point on that pad's centre or on a via)
+3V3  (via drill 0.35)
  Top 0.152: v46.63,17.37 46.63,16.31 R1.1 | v40.84,3.96 40.8,4.01 | 26.98,16.31 R2.1 27.05,12.8 R9.1 R10.1 | C22.1 46.9,19.85 v46.53,19.47
  Top 0.305: IC2.1 40.8,4.01 39.69,2.9 C2.1 37.95,2.52 36.98,1.55 v29.7,1.55 28.39,1.55 v25.6,4.34 | 26.98,16.31 v26.98,24 26.98,24.07 21.6,29.45 J_OLED.1
  Bottom 0.152: 39.76,20.11 U$1.8 | 45.53,18.48 45.34,18.29 41.53,18.29 41.49,18.33 | 45.53,18.48 v46.53,19.47 46.88,19.82 | 46.88,19.82 47.32,20.27 47.32,20.88 47.09,21.11 47.02,21.11 IC1.10 | 39.78,20.04 U$1.8 | 45.53,18.48 v46.63,17.37 | 23.55,22.1 C13.2 | 24.92,24 IC4.8 | IC1.16 43.97,20.64 43.75,20.85 C1.1 42.04,20.29 U$1.8 | IC1.11 46.88,19.82
  Bottom 0.305: 24.97,7.15 24.5,7.15 C6.2 25.38,8.03 25.38,20.26 23.55,22.1 | 24.97,7.15 IC3.5 | 39.76,20.11 C3.1 | C13.2 23.45,22.68 IC4.8 | 39.78,20.04 41.49,18.33 40.84,17.68 v40.84,3.96 | v26.98,24 24.92,24 | v25.6,4.34 24.97,4.98 24.97,7.15 | TP3.3V.1 0.8,10.1 0.8,1.6 1.7,0.7 28.85,0.7 v29.7,1.55
+5V  (via drill 0.35)
  Top 0.152: 10.9,13.79 C17.1 | 26.52,35.13 J_DBG.3
  Top 0.305: D4.1 D3.1 7.22,7.38 U2.7 9.88,7.38 10.8,8.3 10.8,9.1 | R22.2 7.2,12.7 7.7,12.2 | 7.7,12.2 10.8,9.1 | 10.8,9.1 C10.1 C17.1 | 10.9,16 10.9,28.77 19.18,37.05 24.59,37.05 26.52,35.13 | 10.9,16 10.9,13.79 | v46,31.8 44.9,32.9 v30.6,32.9 | v7.7,13.6 7.7,12.2 | C16.1 C15.1 | C15.1 C14.1 | C15.1 13.1,18.2 10.9,16
  Bottom 0.152: 46.4,27.8 C34.1 | 33.85,24.65 33.88,24.69 33.91,24.71 | 28.57,7.24 IC3.1 | 26.59,35.05 J_DBG.3
  Bottom 0.305: C7.2 26.35,3.95 27.2,4.8 | IC3.3 27.65,5.25 27.2,4.8 | IC3.1 27.55,7.15 27.2,6.8 27.2,4.8 | C35.1 42.15,27.1 42.77,27.1 | 42.77,27.1 45.7,27.1 46.4,27.8 | 42.77,27.1 42.77,23.47 38.69,23.47 37.47,24.69 33.88,24.69 | 28.57,7.24 28.57,19.38 33.85,24.65 | 33.91,24.71 33.91,27.3 26.59,34.62 26.59,35.05 28.45,35.05 v30.6,32.9 | U3.6 45.12,30.93 v46,31.8 | TP5V.1 v7.7,13.6
+5V_EN  (via drill 0.35)
  Top 0.152: R19.1 12.05,6.75 12.68,7.38 U2.2 17.73,7.38 v18.1,7 | R7.2 69.55,27.79 68.66,26.89 58.29,26.89 47.47,16.08 47.47,15.7 46.86,15.09 41.68,15.09 IC2.9 41.6,15.01 41.3,15.01 35.66,9.37 28.19,9.37 27.32,8.5 v22.9,8.5
  Bottom 0.152: v18.1,7 19.61,8.5 v22.9,8.5
AMP_IN  (via drill 0.35)
  Top 0.152: v41.7,24.2 41.36,23.86 v41.36,22.73
  Bottom 0.152: v41.36,22.73 39.86,22.73 U$1.6
  Bottom 0.305: JP1.2 41.7,25.09 v41.7,24.2
AUDIO_MOSI  (via drill 0.35)
  Top 0.152: v33.45,21.64 34.34,20.75 34.34,13.95 32.97,12.57 32.38,12.57 IC2.14
  Bottom 0.152: v33.45,21.64 34.59,22.78 34.98,22.78 U$1.3
AUDIO_SCK  (via drill 0.35)
  Top 0.152: v33.53,19.74 33.73,19.54 33.73,15.53 33.29,15.09 32.38,15.09 IC2.12
  Bottom 0.152: v33.53,19.74 33.53,20.42 34.67,21.57 34.98,21.57 U$1.2
AUDIO_SHDN  (via drill 0.35)
  Top 0.152: v34.98,28.73 32.31,31.39 28.73,31.39 28.04,30.71 28.04,29.64 34.84,22.84 34.84,13.43 33.3,11.89 31.32,11.89 31.17,12.04 31.17,12.95 31.93,13.72 32.31,13.72 IC2.13
  Bottom 0.152: U3.1 37.12,29.62 PAD3.1 36.73,29.26 36.2,28.73 v34.98,28.73
DOWN
  Top 0.152: IC2.7 41.68,12.57 47.65,12.57 52.15,17.07 68.23,17.07 68.69,16.61 68.69,15.09 66.53,12.93 66.53,10.38 67.58,9.34 S_DOWN.A2
GND  (via drill 0.35)
  Top 0.152: 12.8,11.8 12.6,11.6 | 74.1,20.35 73.09,20.34 71.87,19.13 68.89,19.13 | 68.89,19.13 68.86,19.09 69.09,18.85 69.09,15.04 67.58,13.52 S_DOWN.B2 | v55.55,20.42 56.92,20.42 S_LEFT.B2 57,20.42 57.92,20.42 58.76,21.26 66.6,21.26 67.51,20.35 S_OK.B2 68.8,19.13 68.89,19.13 | 4.72,8.99 R20.1 | 2.29,2.44 D4.2 | 8.99,6.78 U2.8 | 13.26,8.61 U2.4 | v29.72,3.96 v29.72,3.95 | v4.34,1.98 4.34,2.35 | v43.7,20 42.1,21.6 v41.3,21.6 | L2.2 51.3,29.9 v49.26,27.86 | C22.2 47.3,23.05 v47.3,25.1 | S_UP.B2 67.58,29.3 70,29.3 70.4,28.9 70.4,23.7 73.75,20.35 74.1,20.35 | 74.1,20.35 S_RIGHT.B2
  Top 0.305: D4.2 4.34,2.35 D3.2 8.85,4.9 U2.8 | R20.1 R21.1 | C17.2 12.6,11.6 C10.2 13.35,10.75 U2.4 | R5.2 v29.72,3.95 31.39,3.95 IC2.20 34.31,2.9 C2.2 | 4.72,8.99 2.34,8.99 1.17,7.82 1.17,3.55 2.29,2.44 | 8.99,6.78 10.01,6.78 11.84,8.61 13.26,8.61 | C14.2 C15.2 C16.2 16,13 17.2,11.8
  Top 0.406: C9.2 17.2,11.8 12.8,11.8
  Bottom 0.152: 13,5.8 U1.2 | C4.2 16.75,6.5 | 41.75,30.95 U3.9 | 42.6,28.35 C35.2 43.05,28.1 C34.2 44.65,28.12 45.49,28.96 48.16,28.96 v49.26,27.86 51.97,25.15 51.97,25.1 | 35.04,20.11 U$1.1 | 39.03,21.57 U$1.7 39.8,21.6 v41.3,21.6 | 45.75,22.05 45.85,22.15 IC1.4 IC1.3 45.35,24.25 46.2,25.1 v47.3,25.1 51.97,25.1 | 45.75,22.05 IC1.21 44.85,21.15 IC1.15 44.85,20.35 44.5,20 v43.7,20 43.45,20 C1.2 | IC1.12 46.35,21.45 45.75,22.05 | 21.34,26.06 21.24,25.96 | 24.08,30.1 J_OLED.2 24.08,30.18 | 23.13,33.95 22.99,33.81 | D_USB.K | 24,34.82 J_DBG.2 24.08,34.9 | v29.72,3.96 29.79,3.89 | 36.5,18.59 C3.2 | 4.34,1.39 v4.34,1.98 | 44.35,30.33 U3.7 | 51.97,25.1 55.55,21.52 v55.55,20.42
  Bottom 0.305: C5.2 13.95,6.75 | 13.95,6.75 13,5.8 | 16.75,4.55 R18.1 16.75,1.94 16.2,1.39 | 13.95,6.75 13.95,6.05 14.2,5.8 15.5,5.8 16.75,4.55 | 16.75,6.5 16.75,4.55 | 16.2,1.39 4.34,1.39 2.71,1.39 2,2.1 BAT-.1 9,11.5 9,18 | 29.79,3.89 29.2,3.3 C7.1 26.14,1.39 22.5,1.39 | 22.5,1.39 16.2,1.39 | C6.1 24.1,2.99 22.5,1.39 | U3.7 42.6,30.27 | 42.6,30.27 42.42,30.27 U3.9 | 41.75,30.95 R30.1 R26.1 | 42.6,28.35 42.6,30.27 | C3.2 35.04,20.11 | 39.03,21.57 38.3,22.3 | 38.3,22.3 38.3,23.2 37.4,24.11 U$1.4 | U$1.1 37.3,20.3 38.3,21.3 38.3,22.3 | IC4.4 21.23,25.98 21.24,25.96 21.75,25.45 C13.1 17.8,18.51 17.8,7.55 C4.2 | 9,18 7.2,19.8 J1.GND | 9,18 9,28.4 10.9,30.3 12.8,30.3 13.4,29.7 13.4,28.9 14.2,28.1 16.05,28.1 C12.1 | 21.34,26.06 21.34,27.36 24.08,30.1 | 22.99,33.81 D_USB.K | 24,34.82 23.13,33.95 24.08,32.99 24.08,30.18 | 36.5,18.59 36.5,12.14 29.72,5.36 | 44.35,30.33 45.91,30.33 49.53,33.95 49.53,35.76 48.57,36.72 25.9,36.72 24.08,34.9 | v29.72,3.96 29.72,5.36 | 29.72,5.36 28.88,6.2 IC3.2
  pour Top (isolate 0.305): 0,38.6 0,0 81.1,0 81.1,38.6
  pour Bottom (isolate 0.305): 0,38.6 0,0 81.1,0 81.1,38.6
L_OUT  (via drill 0.35)
  Top 0.152: v40.36,24.11 39.77,24.11 38.66,22.99 38.66,20.48 40.44,18.7 C19.2
  Bottom 0.152: v40.36,24.11 v40.36,24.12 39.7,24.11 U$1.5
  Bottom 0.305: v40.36,24.11 40.36,25 40.17,25.19 JP2.2
LEFT
  Top 0.152: S_LEFT.A2 56.92,15.85 54.71,15.85 47.62,8.76 41.68,8.76 IC2.4
N$1  (via drill 0.35)
  Top 0.152: C18.2 52.2,32 v48,27.8
  Bottom 0.152: v48,27.8 46.7,26.5 45.9,26.5 44.85,25.45 IC1.2
N$2  (via drill 0.35)
  Top 0.152: Y1.1 14.5,24.3 v16.1,22.7
  Bottom 0.152: v16.1,22.7 16.65,23.25 C8.1
N$3
  Bottom 0.152: C8.2 18.57,24.02 IC4.1
N$4  (via drill 0.35)
  Top 0.152: v9.68,11.28 9.68,29.82 5.7,33.8 D_FULL.K
  Bottom 0.152: U1.1 PAD_CH.1 12.34,3.35 6.55,3.35 6.17,2.97 4.65,2.97 4.5,3.12 4.5,6.1 v9.68,11.28 | U1.1
N$5
  Bottom 0.152: R6.2 2.13,35.18 D_FULL.A
N$6
  Bottom 0.152: C11.2 16.65,25.38 14.5,23.23 Y1.2
N$7
  Bottom 0.152: IC4.2 19.18,24.68 C11.1
N$8
  Bottom 0.152: IC4.3 19.57,25.32 19.2,25.7 19.2,26.7 18.4,27.5 C12.2 R3.2
N$9
  Bottom 0.152: D1.C 16.55,29.2 R3.1
N$10
  Bottom 0.152: R18.2 15,3.65 U1.5
N$11
  Top 0.152: R20.2 7.42,8.03 U2.6
N$12
  Top 0.152: IC2.18 27.68,7.42 R4.1 27.7,7.35 R5.1
N$13
  Top 0.152: R7.1 71.25,30.12 S_PWR.B2
N$14
  Bottom 0.152: R8.2 9.15,32.92 D_USB.A
N$15
  Top 0.152: L2.1 57.55,29.95 C18.1 57.55,33.25 J_ANT.1
N$16  (via drill 0.35)
  Top 0.152: C19.1 43.8,19.3 v44.8,19.3
  Bottom 0.152: v44.8,19.3 45.35,19.85 IC1.14
N$21
  Top 0.406: U2.1 17.73,2.35 L1.2
N$22
  Top 0.152: U2.5 8.85,9.57 7.53,10.9 R21.2 4.75,12.6 R22.1
N$25
  Bottom 0.152: 39.88,31.05 U3.3
  Bottom 0.305: R29.2 R28.2 39.88,31.05
N$27
  Bottom 0.152: 40.05,31.62 U3.4
  Bottom 0.305: R26.2 R30.2 40.05,31.62
N$29
  Bottom 0.152: 37.55,32.8 R28.1 R29.1
  Bottom 0.305: C33.1 37.55,32.8
N$34
  Bottom 0.152: 34.98,34.75 35.01,34.8 | 39.62,26.06 JP2.1
  Bottom 0.305: JP2.1 JP1.1 | 35.01,34.8 C33.2 | 34.98,34.75 34.98,29.74 34.27,29.03 34.27,28.32 36.53,26.06 39.62,26.06
OK
  Top 0.152: IC2.8 41.6,13.72 41.3,13.72 40.46,12.88 40.46,12.12 40.69,11.89 47.52,11.89 52.4,16.76 60.51,16.76 61.43,15.85 S_OK.A2
RIGHT
  Top 0.152: IC2.5 41.6,9.91 40.9,9.91 40.16,9.17 40.16,7.31 40.62,6.86 48.4,6.86 49.82,5.43 68.44,5.43 69.9,6.89 69.9,9.7 76,15.8 78.17,15.8 S_RIGHT.A2
RST  (via drill 0.35)
  Top 0.152: v46.4,24.2 45.5,25.1 40.1,25.1 38.1,23.1 38.1,20.6 41.3,17.4 v43.3,17.4 | v34.1,6.2 34.05,6.16 IC2.19
  Bottom 0.152: IC1.5 46.35,24.15 v46.4,24.2 | v43.3,17.4 42.2,16.3 42.2,3.2 41.6,2.6 37.7,2.6 v34.1,6.2
S+
  Bottom 0.305: J_SPK.1 47.2,35.2 44.2,32.2 U3.5
S-
  Bottom 0.305: U3.8 47.02,29.62 50.84,33.44 J_SPK.2
SCL
  Top 0.152: IC2.11 32.31,16.31 28.8,16.31 R2.2 28.8,16.38 28.8,28.35 26.75,30.4 J_OLED.3
  Bottom 0.152: IC4.6 23.77,25.32 23.6,25.5 23.6,26.3 26.68,29.38 J_OLED.3
SCLK  (via drill 0.35)
  Top 0.152: v45.72,10.67 37.71,10.67 35.81,8.76 32.38,8.76 IC2.17 v30.5,8.7 | R9.2 29.15,12.4 v30.4,12.4
  Bottom 0.152: v45.72,10.67 47.93,12.88 47.93,21.95 47.24,22.63 47.02,22.63 IC1.7 | v30.4,12.4 30.5,12.3 v30.5,8.7
SDA
  Top 0.152: R1.2 44.88,16.31 IC2.10 41.6,16.38 41.6,16.55 29.22,28.94 J_OLED.4
  Bottom 0.152: IC4.5 25.02,25.98 J_OLED.4
SDIO  (via drill 0.35)
  Top 0.152: v46.63,18.29 45.8,17.45 45.8,15.7 45.64,15.54 42.82,15.54 42.75,15.62 37.49,15.62 33.15,11.28 32.38,11.28 IC2.15 31.79,10.7 R10.2
  Bottom 0.152: v46.63,18.29 47.62,19.28 47.62,21.79 47.32,22.1 47.02,22.1 IC1.8
SEN  (via drill 0.35)
  Top 0.152: v45.9,6.2 41.72,6.2 IC2.2
  Bottom 0.152: IC1.6 48.94,23.16 50.7,21.4 50.7,15.2 48.4,12.9 48.4,11.9 45.9,9.4 v45.9,6.2
TUNE  (via drill 0.35)
  Top 0.152: v43.51,23.16 43.75,23.16 45.91,21.01 45.91,18.17 v45.11,17.37 | v43.13,8.08 42.29,8.08 41.68,7.47 IC2.3
  Bottom 0.152: v43.51,23.16 43.51,22.1 43.89,21.72 44.2,21.72 IC1.18 | v45.11,17.37 45.11,10.06 v43.13,8.08
UP  (via drill 0.35)
  Top 0.152: v48.92,11.38 41.7,11.38 IC2.6 | v60.97,24 66.83,24 S_UP.A2
  Bottom 0.152: v60.97,24 60.15,24 48.92,12.78 v48.92,11.38
UPDI
  Top 0.152: IC2.16 32.31,9.98 31.8,9.98 31.52,9.7 28.6,9.7 28.2,10.1 28.2,13.49 27.89,13.8 27.89,24.16 22.78,29.27 22.78,33.83 21.57,35.05 J_DBG.1
VBUS
  Bottom 0.152: 16.6,8.35 C4.1 16.92,8.38 16.92,22.63 17.45,23.16 17.45,29.95 16.69,30.71 10.29,30.71 9.83,30.25 8.08,30.25 7.47,30.86 R8.1 7.45,33.45 5.1,35.8 R6.1
  Bottom 0.305: J1.VBUS 5.2,17.2 4.7,17.7 4.7,20.4 7.35,23.05 7.35,30.9 R8.1 | U1.4 16.6,8.35
VCC  (via drill 0.35)
  Top 0.152: 25.91,7.47 R4.2 | 18.2,13.9 18.07,13.95 | v11.12,6.78 10.95,6.95
  Top 0.305: R19.2 10.35,6.35 10.95,6.95 12.03,8.03 13.8,8.03 | S_PWR.A2 69.1,36.78 55.07,36.78 51.91,33.61 25.64,33.61 25.32,33.92 25.32,35.56 24.33,36.55 20.73,36.55 18.07,33.88 18.07,13.95 | 18.2,13.9 C9.1
  Top 0.406: U2.3 13.8,8.03 18.52,8.03 L1.1 | C9.1 20.5,11.6 L1.1 | 25.91,7.47 21.92,7.47 L1.1
  Bottom 0.152: 12.4,8.35 C5.1 | v11.12,6.78 11.12,6.75
  Bottom 0.305: 12.4,8.35 U1.3 11.12,6.75 7.65,6.75 BAT+.1 | D1.A C5.1

### Text on the board
tPlace: ATtiny3216 | PAM2401
bPlace: JLCJLCJLCJLC | FM tuner | RTC | Features: / FM tuner (SI4703-C19-GM) / Digital volume pot. (MCP41010) / RTC (MCP79402) / OLED display (SH1106) / LiPo battery / USB charging (MCP73831) / Control buttons / ATtiny3216 MCU | La mulți ani!!! | Tiny FM Radio by Cosmin Dumitru (Kozma) / 5 Apr. 2021